# Altium schematic sheet SmartWatch.SchDoc: Smart Watch
size A4; ApprovedBy: Muhammet YILDIZ; CheckedBy: Muhammet YILDIZ; Author: Muhammet YILDIZ; CompanyName: YıLDıZ IoT; DrawnBy: Muhammet YILDIZ; Engineer: Muhammet YILDIZ; Organization: YıLDıZ IoT; Address1: Elperek Mahallesi; Address2: Saray Sokak No:12; Address3: SAKARYA / TURKEY; Revision: 1; SheetNumber: 0; SheetTotal: 7; SheetSize: A4
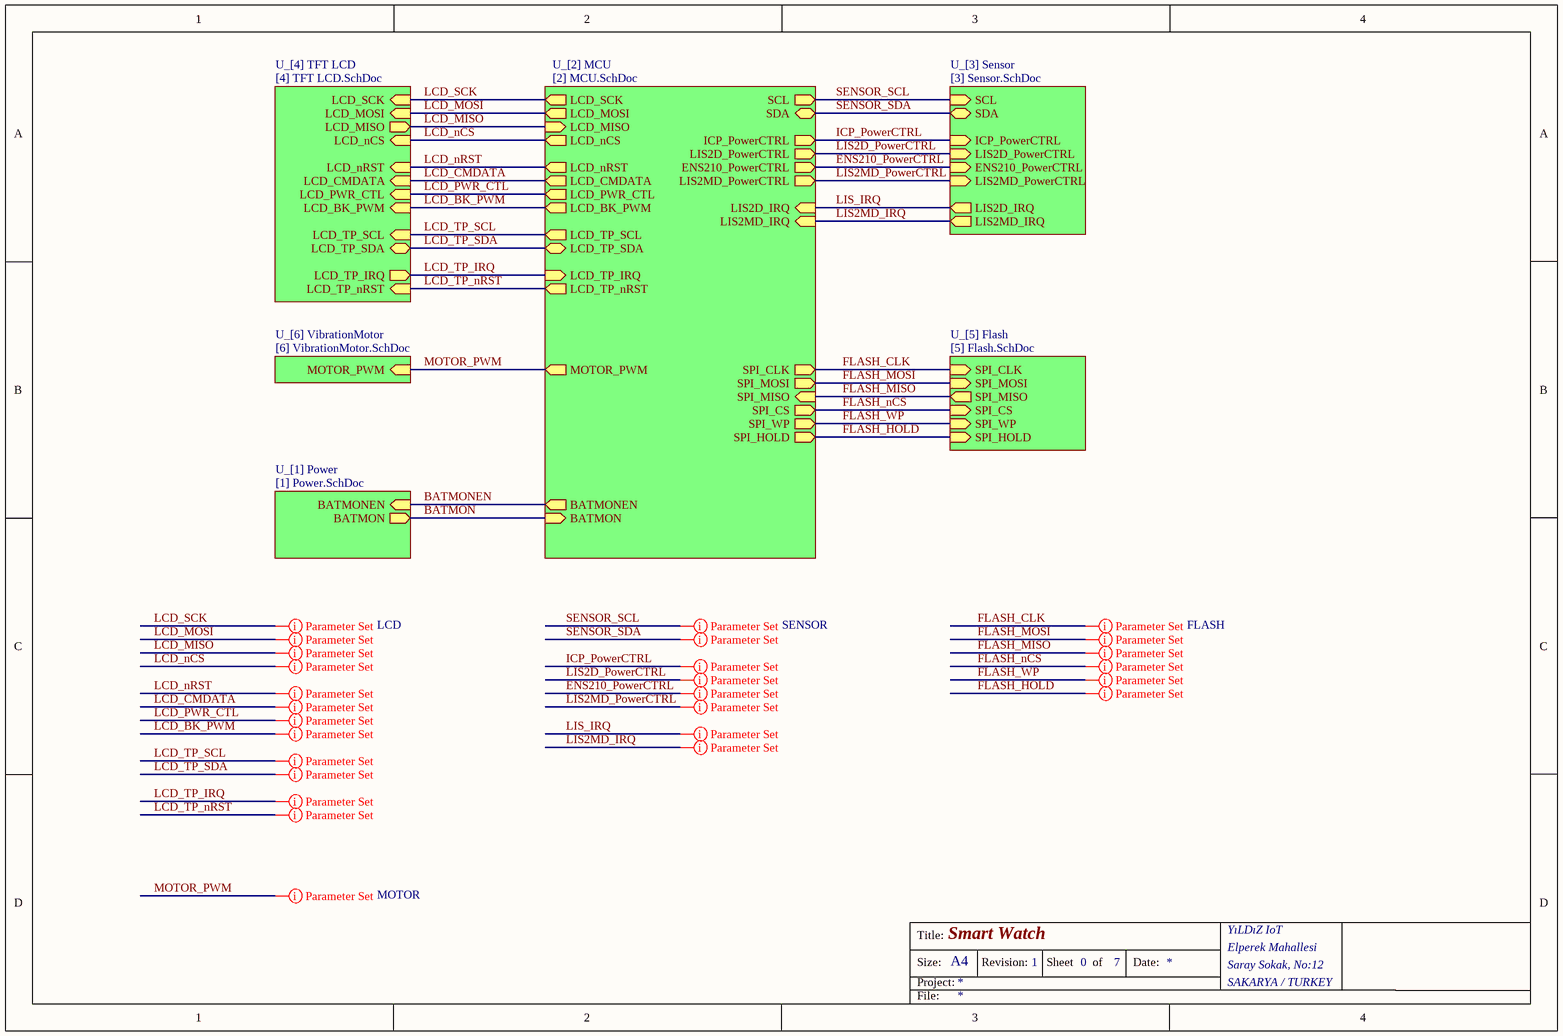
[diagram p0: SmartWatch.SchDoc]

## Sub-sheets
U_[1] Power = [1] Power.SchDoc: BATMONEN (in), BATMON (out)
U_[2] MCU = [2] MCU.SchDoc: ENS210_PowerCTRL (out), SCL (out), SDA (bidir), ICP_PowerCTRL (out), LIS2MD_PowerCTRL (out), LIS2MD_IRQ (in), LIS2D_IRQ (in), LCD_MOSI (out), LCD_MISO (in), LCD_SCK (out), LCD_nCS (out), LCD_nRST (out), LCD_TP_nRST (out), LCD_TP_SDA (bidir), LCD_TP_SCL (out), LCD_TP_IRQ (in), LCD_BK_PWM (out), LCD_PWR_CTL (out), LCD_CMDATA (out), SPI_CS (out), SPI_CLK (out), SPI_MOSI (out), SPI_MISO (in), SPI_HOLD (out), SPI_WP (out), MOTOR_PWM (out), LIS2D_PowerCTRL (out), BATMONEN (out), BATMON (in)
U_[3] Sensor = [3] Sensor.SchDoc: SCL (in), SDA (bidir), LIS2MD_IRQ (out), LIS2MD_PowerCTRL (in), ENS210_PowerCTRL (in), ICP_PowerCTRL (in), LIS2D_IRQ (out), LIS2D_PowerCTRL (in)
U_[4] TFT LCD = [4] TFT LCD.SchDoc: LCD_MOSI (in), LCD_MISO (out), LCD_SCK (in), LCD_nCS (in), LCD_nRST (in), LCD_TP_nRST (in), LCD_TP_SDA (bidir), LCD_TP_SCL (in), LCD_TP_IRQ (out), LCD_BK_PWM (in), LCD_PWR_CTL (in), LCD_CMDATA (in)
U_[5] Flash = [5] Flash.SchDoc: SPI_CS (in), SPI_CLK (in), SPI_MOSI (in), SPI_MISO (out), SPI_HOLD (in), SPI_WP (in)
U_[6] VibrationMotor = [6] VibrationMotor.SchDoc: MOTOR_PWM (in)

## Nets
BATMON: sheet U_[1] Power/BATMON, sheet U_[2] MCU/BATMON
BATMONEN: sheet U_[1] Power/BATMONEN, sheet U_[2] MCU/BATMONEN
ENS210_PowerCTRL: sheet U_[2] MCU/ENS210_PowerCTRL, sheet U_[3] Sensor/ENS210_PowerCTRL
FLASH_CLK: sheet U_[2] MCU/SPI_CLK, sheet U_[5] Flash/SPI_CLK
FLASH_HOLD: sheet U_[2] MCU/SPI_HOLD, sheet U_[5] Flash/SPI_HOLD
FLASH_MISO: sheet U_[2] MCU/SPI_MISO, sheet U_[5] Flash/SPI_MISO
FLASH_MOSI: sheet U_[2] MCU/SPI_MOSI, sheet U_[5] Flash/SPI_MOSI
FLASH_nCS: sheet U_[2] MCU/SPI_CS, sheet U_[5] Flash/SPI_CS
FLASH_WP: sheet U_[2] MCU/SPI_WP, sheet U_[5] Flash/SPI_WP
ICP_PowerCTRL: sheet U_[2] MCU/ICP_PowerCTRL, sheet U_[3] Sensor/ICP_PowerCTRL
LCD_BK_PWM: sheet U_[2] MCU/LCD_BK_PWM, sheet U_[4] TFT LCD/LCD_BK_PWM
LCD_CMDATA: sheet U_[2] MCU/LCD_CMDATA, sheet U_[4] TFT LCD/LCD_CMDATA
LCD_MISO: sheet U_[2] MCU/LCD_MISO, sheet U_[4] TFT LCD/LCD_MISO
LCD_MOSI: sheet U_[2] MCU/LCD_MOSI, sheet U_[4] TFT LCD/LCD_MOSI
LCD_nCS: sheet U_[2] MCU/LCD_nCS, sheet U_[4] TFT LCD/LCD_nCS
LCD_nRST: sheet U_[2] MCU/LCD_nRST, sheet U_[4] TFT LCD/LCD_nRST
LCD_PWR_CTL: sheet U_[2] MCU/LCD_PWR_CTL, sheet U_[4] TFT LCD/LCD_PWR_CTL
LCD_SCK: sheet U_[2] MCU/LCD_SCK, sheet U_[4] TFT LCD/LCD_SCK
LCD_TP_IRQ: sheet U_[2] MCU/LCD_TP_IRQ, sheet U_[4] TFT LCD/LCD_TP_IRQ
LCD_TP_nRST: sheet U_[2] MCU/LCD_TP_nRST, sheet U_[4] TFT LCD/LCD_TP_nRST
LCD_TP_SCL: sheet U_[2] MCU/LCD_TP_SCL, sheet U_[4] TFT LCD/LCD_TP_SCL
LCD_TP_SDA: sheet U_[2] MCU/LCD_TP_SDA, sheet U_[4] TFT LCD/LCD_TP_SDA
LIS2D_PowerCTRL: sheet U_[2] MCU/LIS2D_PowerCTRL, sheet U_[3] Sensor/LIS2D_PowerCTRL
LIS2MD_IRQ: sheet U_[2] MCU/LIS2MD_IRQ, sheet U_[3] Sensor/LIS2MD_IRQ
LIS2MD_PowerCTRL: sheet U_[2] MCU/LIS2MD_PowerCTRL, sheet U_[3] Sensor/LIS2MD_PowerCTRL
LIS_IRQ: sheet U_[2] MCU/LIS2D_IRQ, sheet U_[3] Sensor/LIS2D_IRQ
MOTOR_PWM: sheet U_[2] MCU/MOTOR_PWM, sheet U_[6] VibrationMotor/MOTOR_PWM
SENSOR_SCL: sheet U_[2] MCU/SCL, sheet U_[3] Sensor/SCL
SENSOR_SDA: sheet U_[2] MCU/SDA, sheet U_[3] Sensor/SDA

## Layout directives
net class SENSOR: ENS210_PowerCTRL, ICP_PowerCTRL, LIS2D_PowerCTRL, LIS2MD_IRQ, LIS2MD_PowerCTRL, LIS_IRQ, SENSOR_SCL, SENSOR_SDA
net class LCD: LCD_BK_PWM, LCD_CMDATA, LCD_MISO, LCD_MOSI, LCD_nCS, LCD_nRST, LCD_PWR_CTL, LCD_SCK, LCD_TP_IRQ, LCD_TP_nRST, LCD_TP_SCL, LCD_TP_SDA
net class FLASH: FLASH_CLK, FLASH_HOLD, FLASH_MISO, FLASH_MOSI, FLASH_nCS, FLASH_WP
net class MOTOR: MOTOR_PWM

## Notes on the sheet
- Title:
- Size:
- Project:
- Revision:
- Sheet
- of
- Date:
- YıLDıZ IoT
- Elperek Mahallesi
- Saray Sokak, No:12
- SAKARYA / TURKEY
- File: